# Altium schematic sheet Block_Diagram.SchDoc
size 420 x 297 mm; DrawnBy: Mehmet Hamza Limanlar; Revision: P0; SheetNumber: 2; SheetTotal: 5; ProjectDescription: Wireless Home Security System
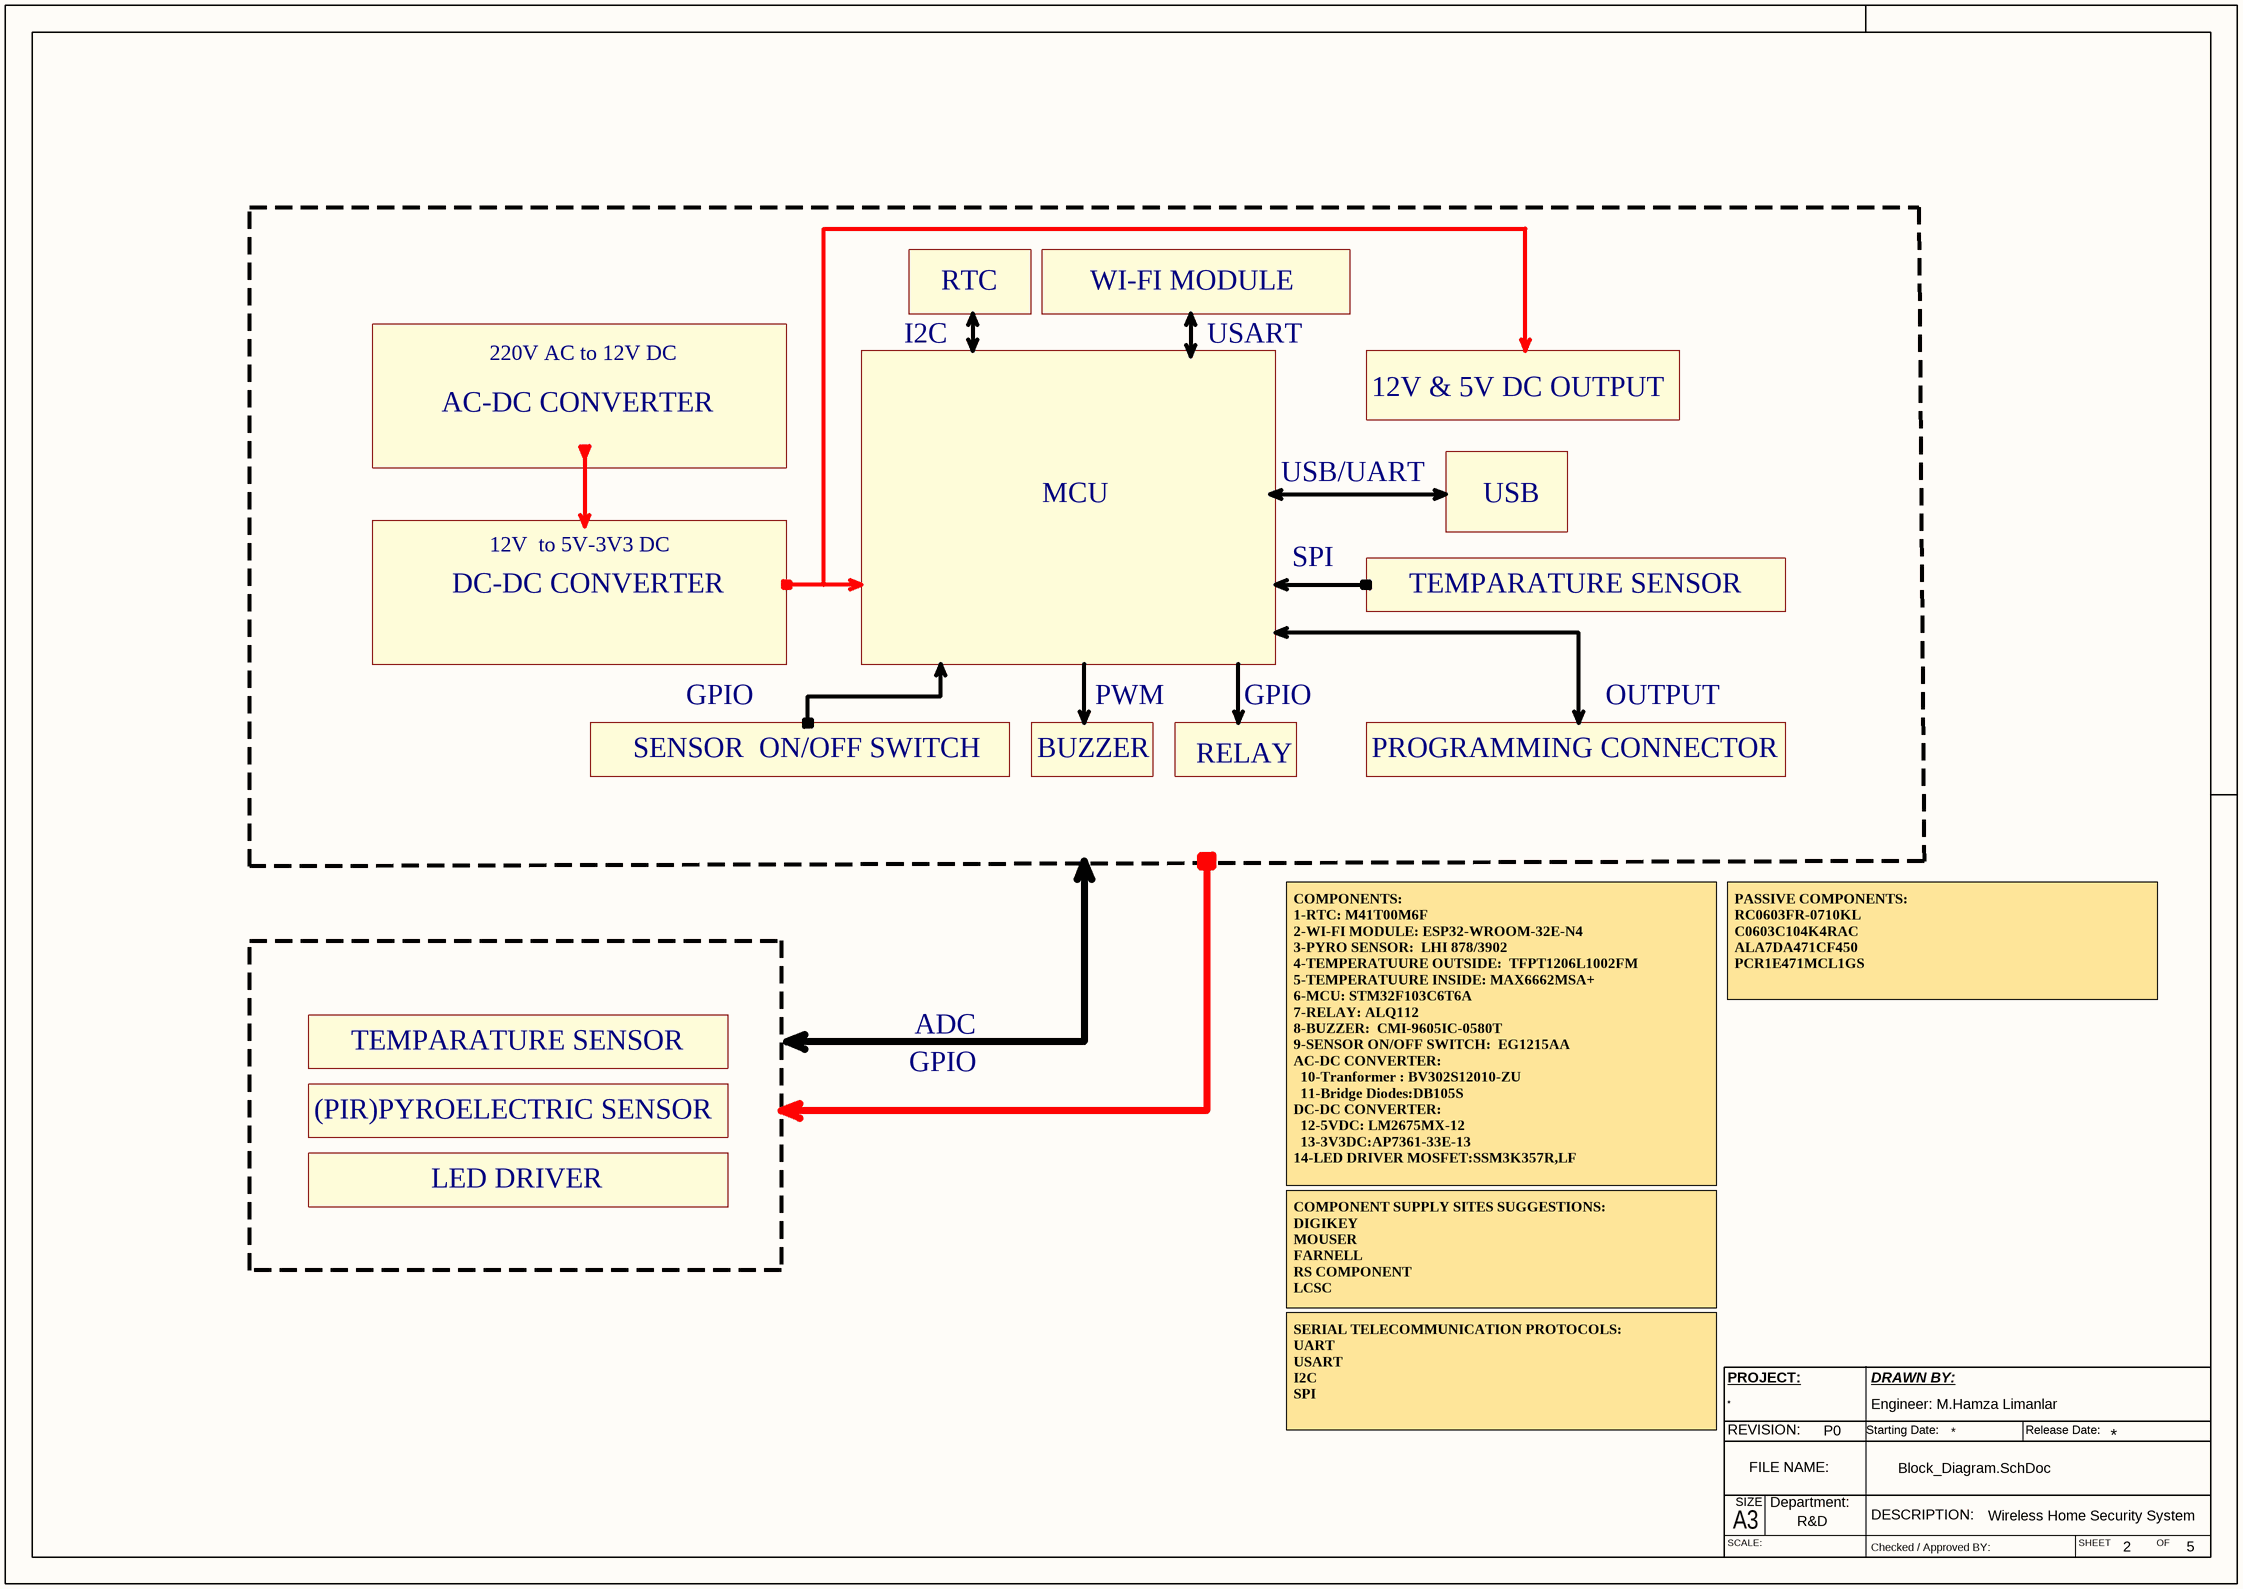
[diagram p0: Block_Diagram.SchDoc]

## Notes on the sheet
- RTC
- WI-FI MODULE
- 220V AC to 12V DC
- I2C
- USART
- AC-DC CONVERTER
- 12V & 5V DC OUTPUT
- MCU
- USB/UART
- USB
- DC-DC CONVERTER
- 12V  to 5V-3V3 DC
- SPI
- TEMPARATURE SENSOR
- GPIO
- PWM
- OUTPUT
- SENSOR  ON/OFF SWITCH
- BUZZER
- RELAY
- PROGRAMMING CONNECTOR
- PASSIVE COMPONENTS:                                                                    RC0603FR-0710KL                                                                                                  C0603C104K4RAC                                                                                                                         ALA7DA471CF450                                                                                                        PCR1E471MCL1GS
- ADC
- (PIR)PYROELECTRIC SENSOR
- LED DRIVER
- COMPONENTS:                                                                                                                                                                                                                                         1-RTC: M41T00M6F                                                                                                                                                                                                               2-WI-FI MODULE: ESP32-WROOM-32E-N4
  3-PYRO SENSOR:  LHI 878/3902
  4-TEMPERATUURE OUTSIDE:  TFPT1206L1002FM
  5-TEMPERATUURE INSIDE: MAX6662MSA+
  6-MCU: STM32F103C6T6A
  7-RELAY: ALQ112
  8-BUZZER:  CMI-9605IC-0580T
  9-SENSOR ON/OFF SWITCH:  EG1215AA
  AC-DC CONVERTER:
  10-Tranformer : BV302S12010-ZU
  11-Bridge Diodes:DB105S
  DC-DC CONVERTER:
  12-5VDC: LM2675MX-12
  13-3V3DC:AP7361-33E-13                                                                                                                                                                                                                                     14-LED DRIVER MOSFET:SSM3K357R,LF
- COMPONENT SUPPLY SITES SUGGESTIONS:                                                             DIGIKEY                                                                                                                   MOUSER                                                                                                                  FARNELL
  RS COMPONENT                                                                                 LCSC
- SERIAL TELECOMMUNICATION PROTOCOLS:
  UART
  USART
  I2C
  SPI
- PROJECT:
- DRAWN BY:
- Engineer: M.Hamza Limanlar
- REVISION:
- FILE NAME:
- Starting Date:
- Release Date:
- SCALE:
- A3
- SIZE
- Department:
- R&D
- Checked / Approved BY:
- DESCRIPTION:
- SHEET
- OF